# EAGLE design placa-gprs (EAGLE 5.10)
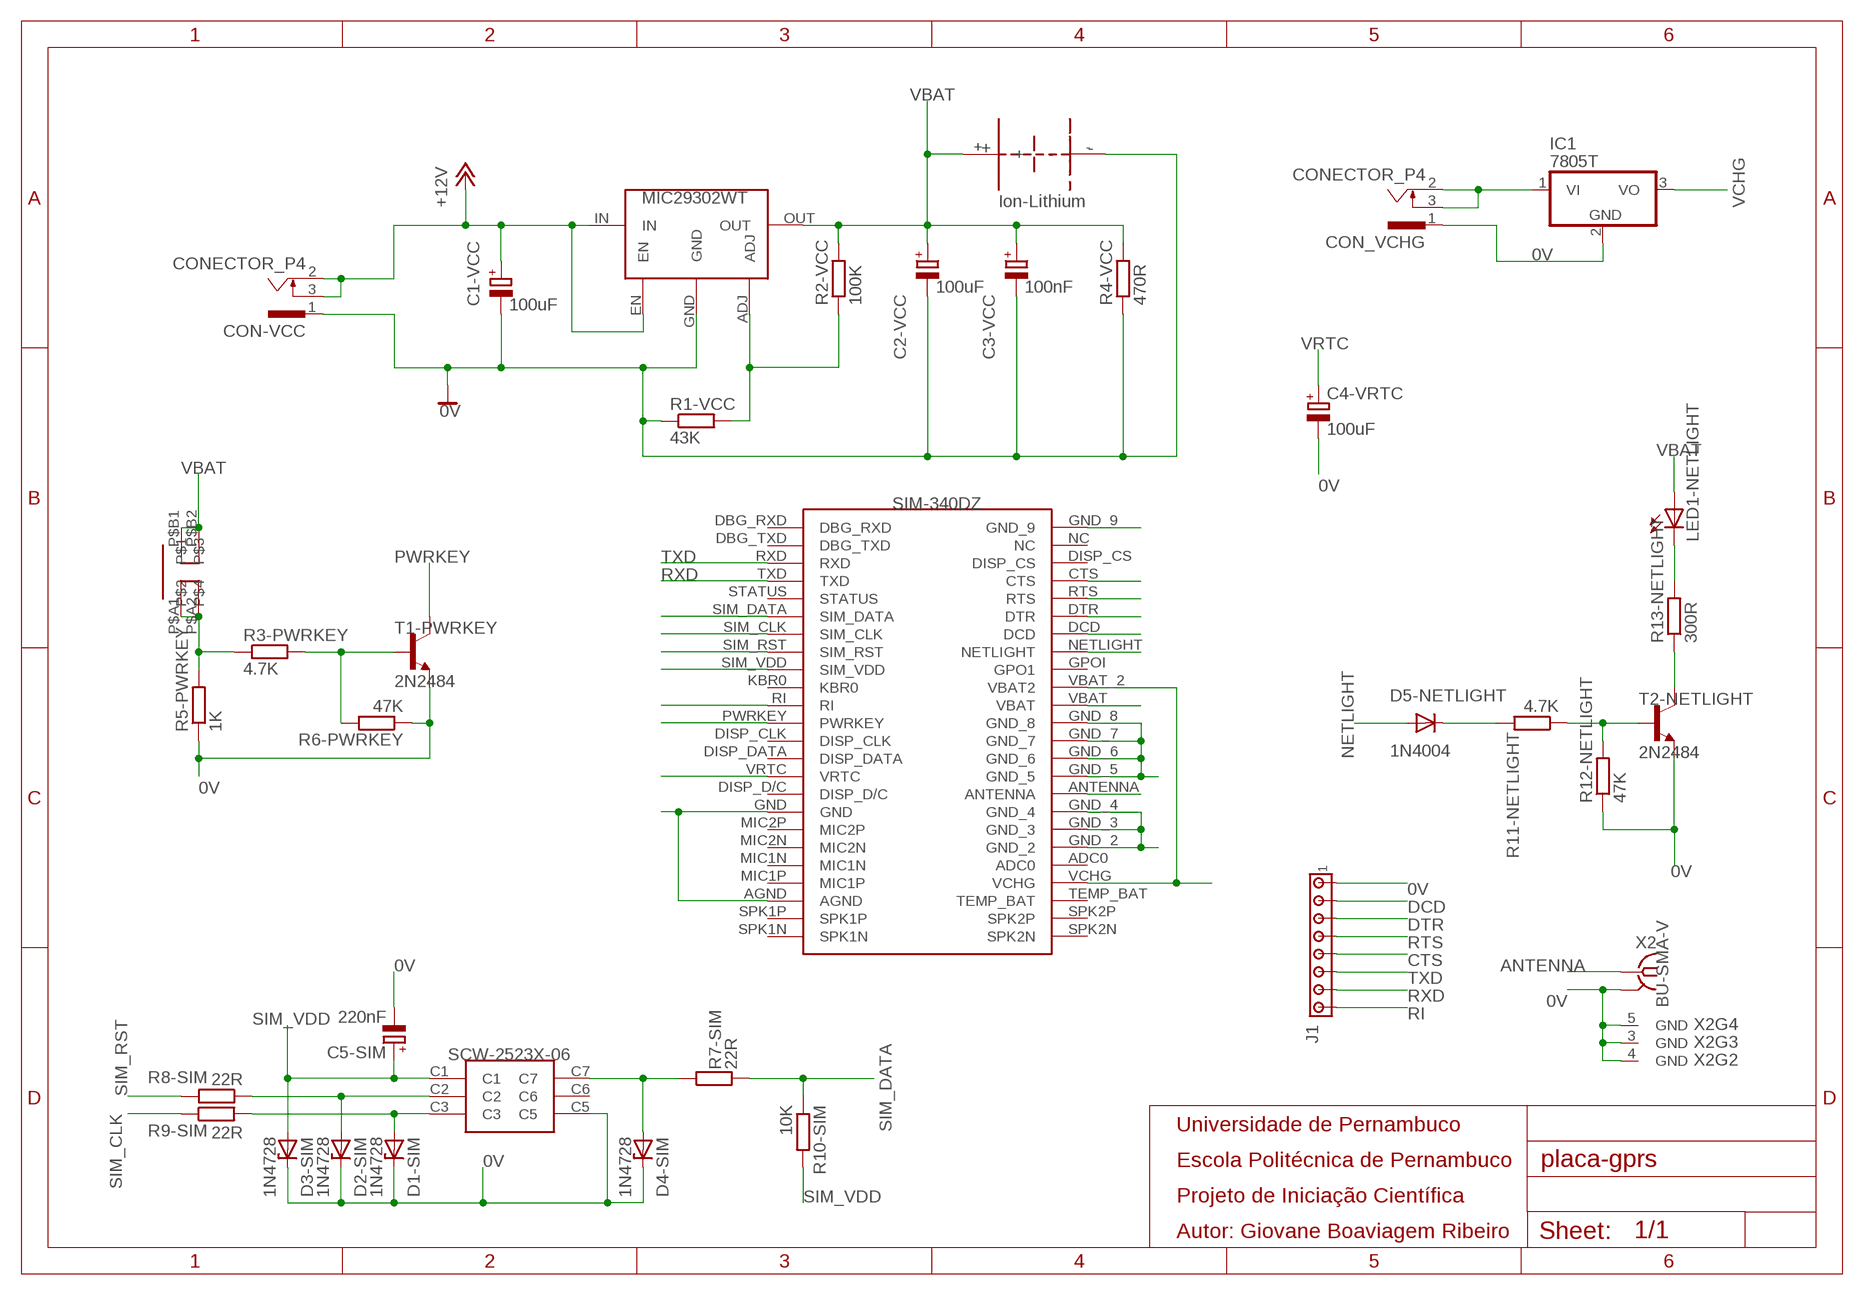
[diagram p0: schematic, sheet 1]

## Parts
C1-VCC  100uF  CPOL-EUTT5D10  [TT5D10]
C2-VCC  100uF  CPOL-EUTT5D10  [TT5D10]
C3-VCC  100nF  CPOL-EUTT5D10  [TT5D10]
C4-VRTC  100uF  CPOL-EUE1.8-4  [E1,8-4]
C5-SIM  220nF  CPOL-EUTT5D10  [TT5D10]
CON-VCC  CONECTOR_P4  [CONECTOR_P4]
CON_VCHG  CONECTOR_P4  [CONECTOR_P4]
D1-SIM  1N4728  [DO41Z10]
D2-SIM  1N4728  [DO41Z10]
D3-SIM  1N4728  [DO41Z10]
D4-SIM  1N4728  [DO41Z10]
D5-NETLIGHT  1N4004  [DO41-10]
IC1  7805T  [TO220H]
J1  MTA08-156  [1X8MTA]
LED1-NETLIGHT  LED5MM  [LED5MM]
R1-VCC  43K  R-EU_0207/7  [0207/7]
R2-VCC  100K  R-EU_0207/7  [0207/7]
R3-PWRKEY  4.7K  R-EU_0204/7  [0204/7]
R4-VCC  470R  R-EU_0207/7  [0207/7]
R5-PWRKEY  1K  R-EU_0204/7  [0204/7]
R6-PWRKEY  47K  R-EU_0204/7  [0204/7]
R7-SIM  22R  R-EU_0207/7  [0207/7]
R8-SIM  22R  R-EU_0207/7  [0207/7]
R9-SIM  22R  R-EU_0207/7  [0207/7]
R10-SIM  10K  R-EU_0207/7  [0207/7]
R11-NETLIGHT  4.7K  R-EU_0207/7  [0207/7]
R12-NETLIGHT  47K  R-EU_0207/7  [0207/7]
R13-NETLIGHT  300R  R-EU_0207/7  [0207/7]
T1-PWRKEY  2N2484  [TO18]
T2-NETLIGHT  2N2484  [TO18]
U$1  BATERIA_3_PINOS  [BATERIA_3_PINOS]
U$2  MIC29302WT  [MIC29302WT]
U$3  BOTAO  [BOTAO_4]
U$4  SCV-W2523X-06  [SCV-W2523X-06]
U$5  SIM-340DZ  [SIM-340DZ]
X2  BU-SMA-V  [BU-SMA-V]

## Nets
0V: C1-VCC.- C2-VCC.- C3-VCC.- C4-VRTC.- C5-SIM.- CON-VCC.1 CON_VCHG.1 D1-SIM.C D2-SIM.C D3-SIM.C D4-SIM.C IC1.2(GND) J1.1 R1-VCC.1 R4-VCC.1 R5-PWRKEY.1 R6-PWRKEY.1 R12-NETLIGHT.1 T1-PWRKEY.1(E) T2-NETLIGHT.1(E) U$1.- U$2.GND U$4.C5 U$5.AGND U$5.GND U$5.GND_2 U$5.GND_3 U$5.GND_4 U$5.GND_5 U$5.GND_6 U$5.GND_7 U$5.GND_8 U$5.GND_9 X2.2(GND) X2.3(GND) X2.4(GND) X2.5(GND)
+12V: C1-VCC.+ CON-VCC.2 CON-VCC.3 CON_VCHG.2 CON_VCHG.3 IC1.1(VI) U$2.EN U$2.IN
ANTENNA: U$5.ANTENNA X2.1
CTS: J1.5 U$5.CTS
DCD: J1.2 U$5.DCD
DTR: J1.3 U$5.DTR
N$1: R3-PWRKEY.1 R5-PWRKEY.2 U$3.P$A1 U$3.P$A2
N$2: R3-PWRKEY.2 R6-PWRKEY.2 T1-PWRKEY.2(B)
N$3: R1-VCC.2 R2-VCC.1 U$2.ADJ
N$4: D4-SIM.A R7-SIM.1 U$4.C7
N$5: D1-SIM.A R9-SIM.2 U$4.C3
N$6: D2-SIM.A R8-SIM.1 U$4.C2
N$7: LED1-NETLIGHT.K(C) R13-NETLIGHT.2
N$8: D5-NETLIGHT.C R11-NETLIGHT.2
N$9: R11-NETLIGHT.1 R12-NETLIGHT.2 T2-NETLIGHT.2(B)
N$10: R13-NETLIGHT.1 T2-NETLIGHT.3(C)
NETLIGHT: D5-NETLIGHT.A U$5.NETLIGHT
PWRKEY: T1-PWRKEY.3(C) U$5.PWRKEY
RI: J1.8 U$5.RI
RTS: J1.4 U$5.RTS
RXD: J1.7 U$5.TXD
SIM_CLK: R9-SIM.1 U$5.SIM_CLK
SIM_DATA: R7-SIM.2 R10-SIM.1 U$5.SIM_DATA
SIM_RST: R8-SIM.2 U$5.SIM_RST
SIM_VDD: C5-SIM.+ D3-SIM.A R10-SIM.2 U$4.C1 U$5.SIM_VDD
TXD: J1.6 U$5.RXD
VBAT: C2-VCC.+ C3-VCC.+ LED1-NETLIGHT.A R2-VCC.2 R4-VCC.2 U$1.+ U$2.OUT U$3.P$B1 U$3.P$B2 U$5.VBAT
VCHG: IC1.3(VO) U$5.VBAT_2(VBAT2) U$5.VCHG
VRTC: C4-VRTC.+ U$5.VRTC
Unconnected: U$4.C6 U$5.ADC0 U$5.DBG_RXD U$5.DBG_TXD U$5.DISP_CLK U$5.DISP_CS U$5.DISP_D/C U$5.DISP_DATA U$5.GPOI(GPO1) U$5.KBR0 U$5.MIC1N U$5.MIC1P U$5.MIC2N U$5.MIC2P U$5.NC U$5.SPK1N U$5.SPK1P U$5.SPK2N U$5.SPK2P U$5.STATUS U$5.TEMP_BAT

## Notes on the sheet
- Universidade de Pernambuco
- Escola Politécnica de Pernambuco
- Projeto de Iniciação Científica
- Autor: Giovane Boaviagem Ribeiro

## Library data of the parts
C1-VCC C2-VCC C3-VCC C4-VRTC C5-SIM = rcl:CPOL-EU: POLARIZED CAPACITOR, European symbol
CON-VCC CON_VCHG = canivete:CONECTOR_P4
D1-SIM D2-SIM D3-SIM D4-SIM = diode:1N4728: Z DIODE 3.3 V, 1W, 5 percent
D5-NETLIGHT = diode:1N4004: DIODE general purpose rectifier, 1 A
IC1 = linear:78*: Positive VOLTAGE REGULATOR Source: http://cache.national.com/ds/LM/LM78L05.pdf http://www.fairchildsemi.com/ds/LM/LM7805.pdf
J1 = con-amp:MTA08-156: AMP connector
LED1-NETLIGHT = led:LED: LED OSRAM: - CHIPLED LG R971, LG N971, LY N971, LG Q971, LY Q971, LO R971, LY R971 LH N974, LH R974 LS Q976, LO Q976, LY Q976 LO Q996 - Hyper CHIPLED LW Q18S LB Q993, LB Q99A, LB R99A - SideLED LS A670, LO A670, LY A670, LG A670, LP A670 LB A673, LV A673, LT A673, LW A673 LH A674 LY A675 LS A676, LA A676, LO A676, LY A676, LW A676 LS A679, LY A679, LG A679 - Hyper Micro SIDELED® LS Y876, LA Y876, LO Y876, LY Y876 LT Y87S - SmartLED LW L88C, LW L88S LB L89C, LB L89S, LG L890 LS L89K, LO L89K, LY L89K LS L896, LA L896, LO L896, LY L896 - TOPLED LS T670, LO T670, LY T670, LG T670, LP T670 LSG T670, LSP T670, LSY T670, LOP T670, LYG T670 LG T671, LOG T671, LSG T671 LB T673, LV T673, LT T673, LW T673 LH T674 LS T676, LA T676, LO T676, LY T676, LB T676, LH T676, LSB T676, LW T676 LB T67C, LV T67C, LT T67C, LS T67K, LO T67K, LY T67K, LW E67C LS E67B, LA E67B, LO E67B, LY E67B, LB E67C, LV E67C, LT E67C LW T67C LS T679, LY T679, LG T679 LS T770, LO T770, LY T770, LG T770, LP T770 LB T773, LV T773, LT T773, LW T773 LH T774 LS E675, LA E675, LY E675, LS T675 LS T776, LA T776, LO T776, LY T776, LB T776 LHGB T686 LT T68C, LB T68C - Hyper Mini TOPLED® LB M676 - Mini TOPLED Santana® LG M470 LS M47K, LO M47K, LY M47K Source: http://www.osram.convergy.de LUXEON: - LUMILED® LXK2-PW12-R00, LXK2-PW12-S00, LXK2-PW14-U00, LXK2-PW14-V00 LXK2-PM12-R00, LXK2-PM12-S00, LXK2-PM14-U00 LXK2-PE12-Q00, LXK2-PE12-R00, LXK2-PE12-S00, LXK2-PE14-T00, LXK2-PE14-U00 LXK2-PB12-K00, LXK2-PB12-L00, LXK2-PB12-M00, LXK2-PB14-N00, LXK2-PB14-P00, LXK2-PB14-Q00 LXK2-PR12-L00, LXK2-PR12-M00, LXK2-PR14-Q00, LXK2-PR14-R00 LXK2-PD12-Q00, LXK2-PD12-R00, LXK2-PD12-S00 LXK2-PH12-R00, LXK2-PH12-S00 LXK2-PL12-P00, LXK2-PL12-Q00, LXK2-PL12-R00 Source: www.luxeon.com KINGBRIGHT: KA-3528ASYC Source: www.kingbright.com
R1-VCC R2-VCC R3-PWRKEY R4-VCC R5-PWRKEY R6-PWRKEY R7-SIM R8-SIM R9-SIM R10-SIM R11-NETLIGHT R12-NETLIGHT R13-NETLIGHT = rcl:R-EU_: RESISTOR, European symbol
T1-PWRKEY T2-NETLIGHT = transistor:2N2484: NPN TRANSISTOR
U$1 = canivete:BATERIA_3_PINOS: Bateria de íon-lítio com 3 pinos.
U$2 = canivete:MIC29302WT: Regulador de tensão ajustável
U$3 = canivete:BOTAO: Botão simples. Não há a obrigatoriedade de utilizar os 4 pinos.
U$4 = canivete:SCV-W2523X-06: Soquete para SIM Card
U$5 = canivete:SIM-340DZ: Módulo GSM/GPRS
X2 = con-coax:BU-SMA-V: FEMALE SMA CONNECTOR Radiall distributor RS 112-3794

## Net classes
1 Placas caseiras: width 0.5 mm, drill 1 mm, clearance 0.5 mm

## Board
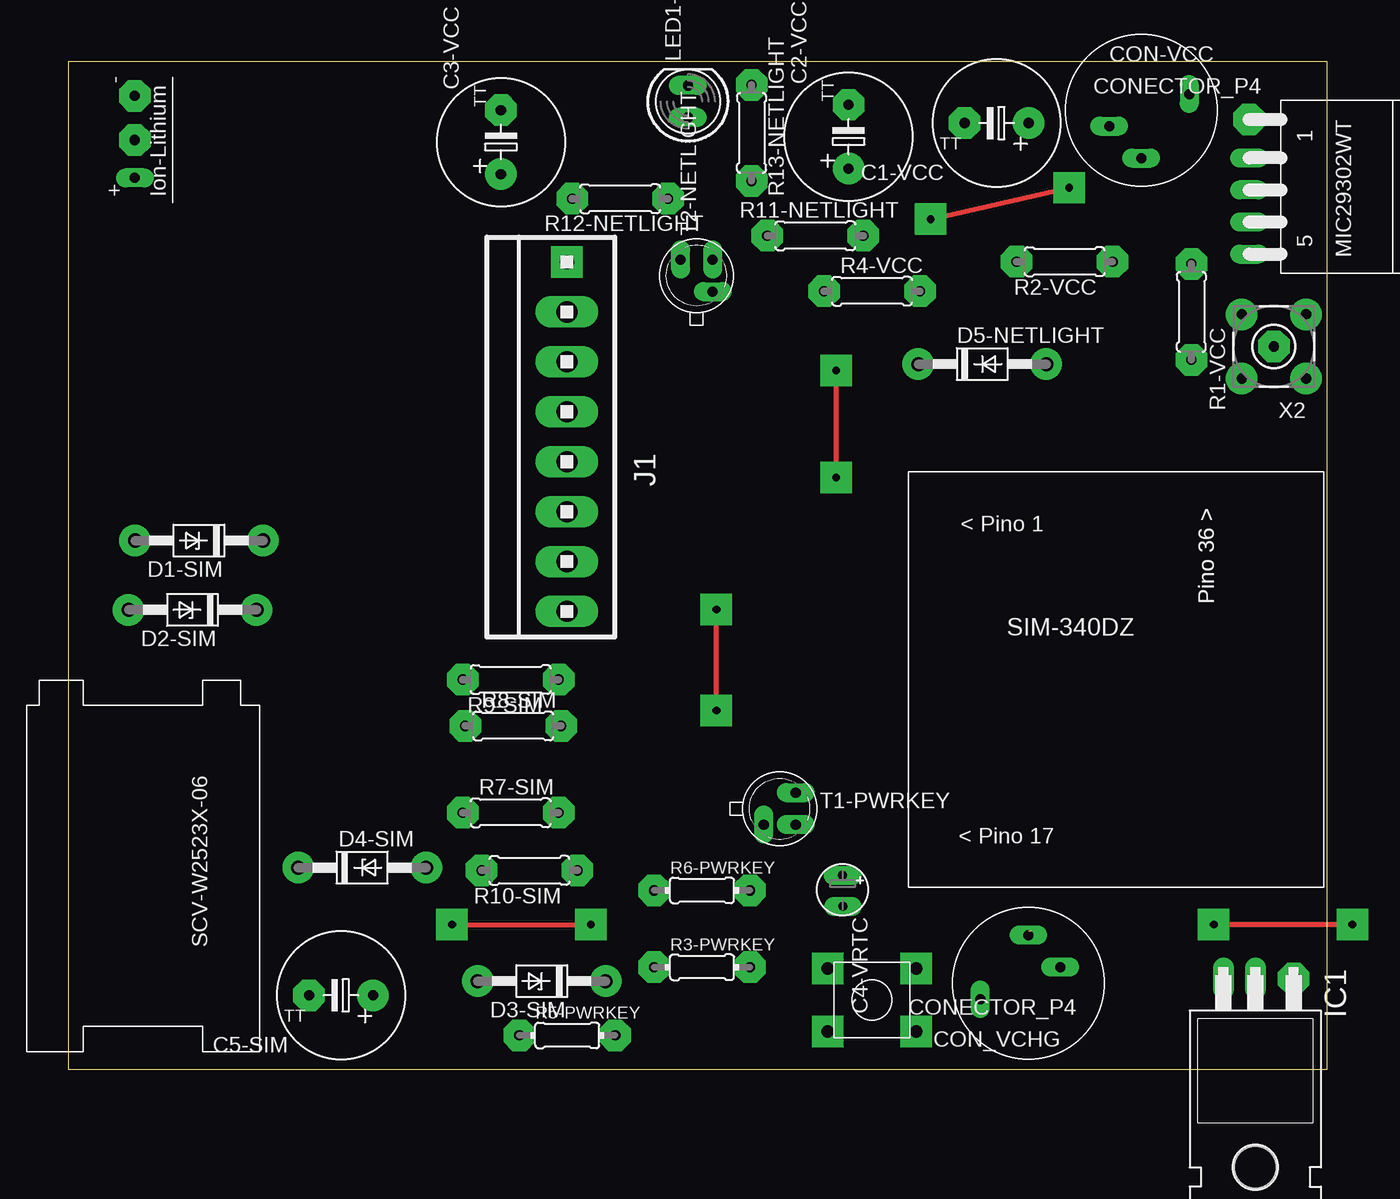
[diagram p1: board, top side]
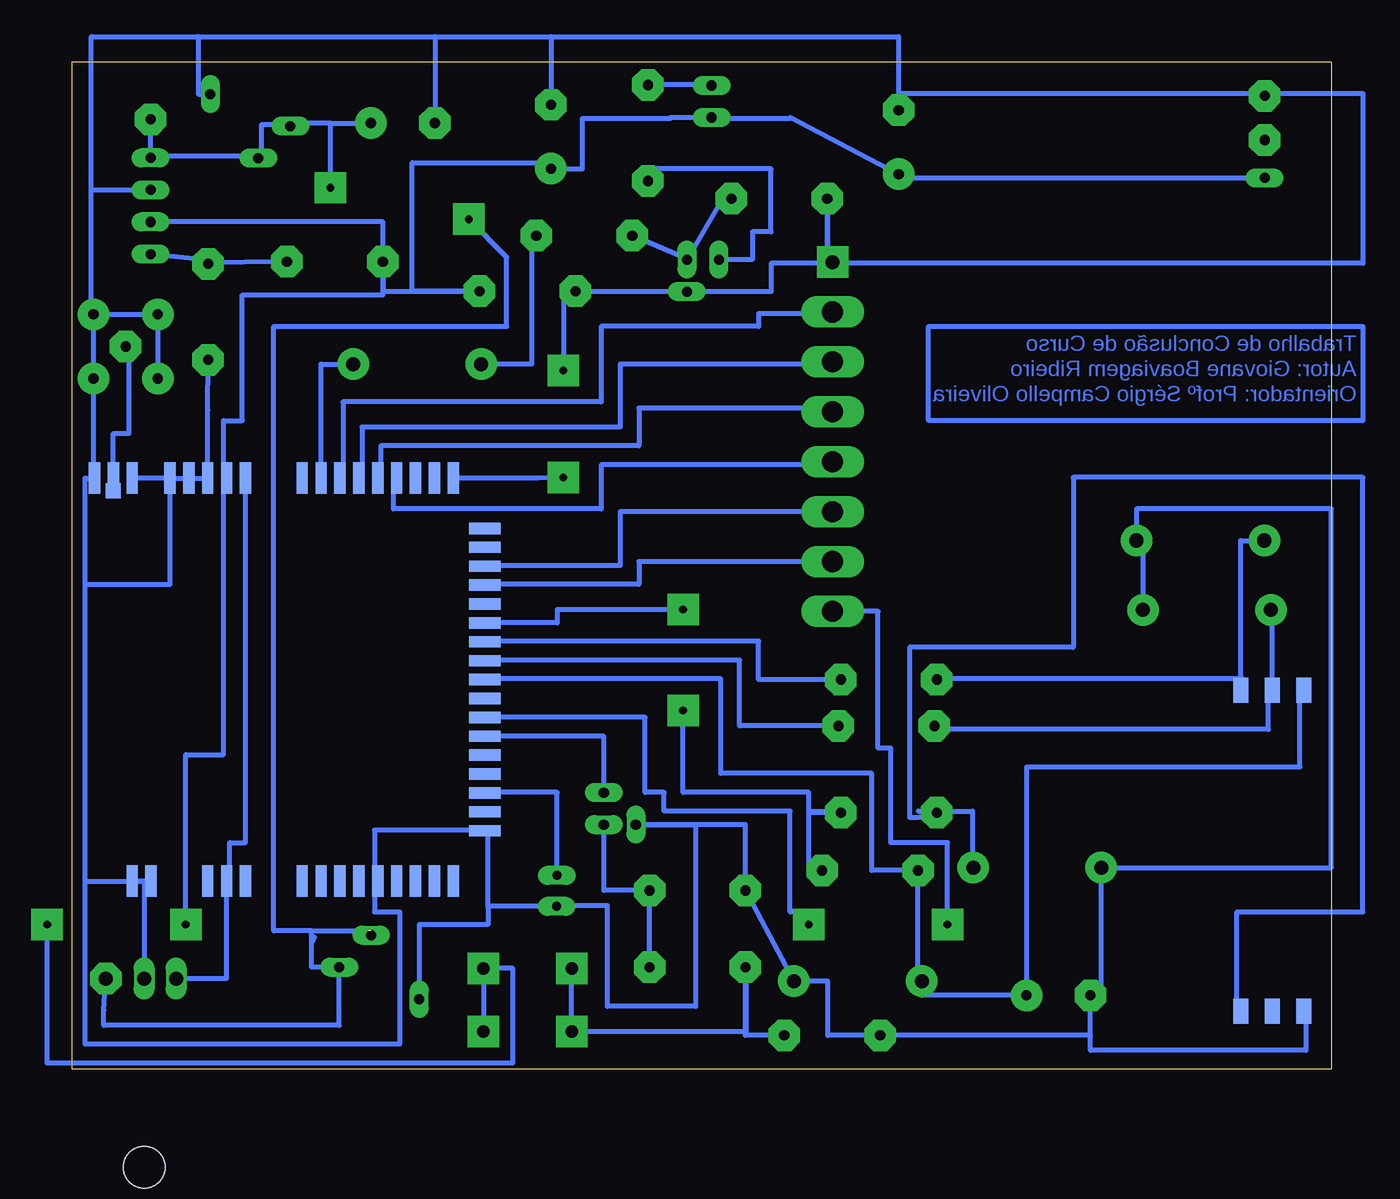
[diagram p2: board, bottom side, seen from below]

Size 100 x 80 mm. Coordinates in mm from the lower left corner, seen from the top.
Outline: 0,0 100,0 100,80 0,80 0,0
Copper layers (1*16): Top 0mm / dielectric 1.5mm / Bottom 0.035mm
Design rules "default *": minimum track width 1mm, minimum drill 24mil, track to track 8mil, track to pad 8mil, pad to pad 8mil, via to via 8mil, smd to smd 8mil, copper to edge 40mil, drill to drill 8mil, minimum pad ring 10mil, minimum via ring 8mil, stop-mask expansion 4mil, vias tented up to drill 0mil, thermal gap 10mil

### Footprints (pad centres in the part's own frame; a part is rotated, then mirrored left to right if it is on the bottom)
TT5D10 = drill 0.813 pad 2.5 round: + -2.54,0 | drill 0.813 pad 2.5 octagon: - 2.54,0
E1,8-4 = drill 0.711 pad 1.5 long: + -1.15,0.011; - 1.3,0.039
CONECTOR_P4 = drill 0.8 pad 1.5 long: 1 -1.27,3.81; 2 3.81,0; 3 1.27,-2.54
DO41Z10 = drill 1.118 pad 2.5 round: A 5.08,0; C -5.08,0
DO41-10 = drill 1.118 pad 2.5 round: A 5.08,0; C -5.08,0
TO220H = drill 1.118 pad 2.5 octagon: 1 -3.04,-10.16 | drill 1.118 long: 2 0,-10.16; 3 2.54,-10.16 | hole 3.302: 0,4.826
1X8MTA = drill 1.1 pad 2.5 square: 1 13.868,0 | drill 1.676 long: 2 9.906,0; 3 5.944,0; 4 1.981,0; 5 -1.981,0; 6 -5.944,0; 7 -9.906,0; 8 -13.868,0
LED5MM = drill 0.813 pad 1.5 long: A -1.27,0; K 1.27,0
0207/7 = drill 0.813 pad 2.5 octagon: 1 -3.81,0; 2 3.81,0
0204/7 = drill 0.813 pad 2.5 octagon: 1 -3.81,0; 2 3.81,0
TO18 = drill 0.813 pad 1.5 long: 1 -1.27,-1.27; 2 1.27,-1.27; 3 1.27,1.27
BATERIA_3_PINOS = drill 0.8 pad 1.5 long: + -3,0 | drill 0.8 pad 2.5 octagon: - 3.5,0; P$1 0,0
MIC29302WT = drill 0.8 pad 1.5 long: ADJ 5.096,-6.35; GND 0,-6.35; IN -2.548,-6.35; OUT 2.548,-6.35 | drill 0.8 pad 2.5 octagon: EN -5.596,-6.35
BOTAO_4 = drill 1 pad 2.5 square: P$A1 -3.5,2.5; P$A2 -3.5,-2.5; P$B1 3.5,-2.5; P$B2 3.5,2.5
SCV-W2523X-06 = smd 2 x 1.2 bottom: C1 -14.39,-5.08; C2 -14.39,-2.58; C3 -14.39,-0.08; C5 11.11,-5.08; C6 11.11,-2.58; C7 11.11,-0.08
SIM-340DZ = smd 0.9 x 2.5 bottom: ADC0 5.82,-15.65; AGND -7.68,-15.65; ANTENNA 13.32,16.35; CTS -9.18,16.35; DCD -4.68,16.35; DISP_CS -10.68,16.35; DTR -6.18,16.35; GND_2 10.32,-15.65; GND_3 11.82,-15.65; GND_4 14.82,16.35; GND_5 11.82,16.35; GND_6 8.82,16.35; GND_7 7.32,16.35; GND_8 5.82,16.35; GND_9 -13.68,16.35; GPOI -1.68,16.35; MIC1N -10.68,-15.65; MIC1P -9.18,-15.65; MIC2N -12.18,-15.65; MIC2P -13.68,-15.65; NC -12.18,16.35; NETLIGHT -3.18,16.35; RTS -7.68,16.35; SPK1N -4.68,-15.65; SPK1P -6.18,-15.65; SPK2N -3.18,-15.65; SPK2P -1.68,-15.65; TEMP_BAT 2.82,-15.65; VBAT 4.32,16.35; VBAT_2 2.82,16.35; VCHG 4.32,-15.65 | smd 2.5 x 0.9 bottom: DBG_RXD -16.18,12.35; DBG_TXD -16.18,10.85; DISP_CLK -16.18,-5.65; DISP_D/C -16.18,-10.15; DISP_DATA -16.18,-7.15; GND -16.18,-11.65; KBR0 -16.18,-1.15; PWRKEY -16.18,-4.15; RI -16.18,-2.65; RXD -16.18,9.35; SIM_CLK -16.18,3.35; SIM_DATA -16.18,4.85; SIM_RST -16.18,1.85; SIM_VDD -16.18,0.35; STATUS -16.18,6.35; TXD -16.18,7.85; VRTC -16.18,-8.65 | smd 1.2 x 1.2 bottom:  13.32,15.35
BU-SMA-V = drill 0.813 pad 2.5 octagon: 1 0,0 | drill 0.813 pad 2.5 round: 2 -2.55,2.55; 3 2.55,2.55; 4 2.55,-2.55; 5 -2.55,-2.55

### Placement (x,y rotation side)
C1-VCC  73.75,75.14 180 top
C2-VCC  61.99,74.05 90 top
C3-VCC  34.38,73.62 90 top
C4-VRTC  61.51,14.25 270 top
C5-SIM  21.68,5.88 180 top
CON-VCC  85.24,76.16 270 top
CON_VCHG  76.27,6.84 90 top
D1-SIM  10.4,41.99 180 top
D2-SIM  9.89,36.49 180 top
D3-SIM  37.62,7.01 180 top
D4-SIM  23.36,16.01 0 top
D5-NETLIGHT  72.61,55.99 0 top
IC1  94.3,-2.95 180 top
J1  39.62,50.23 90 top
LED1-NETLIGHT  49.23,76.85 90 top
R1-VCC  89.22,60.15 90 top
R2-VCC  79.15,64.13 180 top
R3-PWRKEY  50.35,8.11 0 top
R4-VCC  63.85,61.79 0 top
R5-PWRKEY  39.65,2.7 0 top
R6-PWRKEY  50.35,14.21 0 top
R7-SIM  35.15,20.38 0 top
R8-SIM  35.35,27.27 0 top
R9-SIM  35.15,30.95 180 top
R10-SIM  36.65,15.8 180 top
R11-NETLIGHT  59.35,66.19 0 top
R12-NETLIGHT  43.85,69.13 0 top
R13-NETLIGHT  54.29,74.35 90 top
T1-PWRKEY  56.52,20.7 0 top
T2-NETLIGHT  49.92,63.02 90 top
U$1  5.3,73.79 90 top
U$2  100.14,69.83 270 top
U$3  63.85,5.51 0 top
U$4  7.29,15.72 270 top
U$5  83.43,30.6 0 top
X2  95.77,57.4 180 top

### Tracks (layer width: path | path; a pad name or v marks a point on that pad's centre or on a via)
0V  (via drill 0.6 pad 2.5)
  Top 0.406: v61,55.5 v61,47
  Bottom 0.406: U$4.C5 2,4.61 2,1.5 19.14,1.5 19.14,2.7 | 19.14,2.7 C5-SIM.- 18.28,5.88 D4-SIM.C 0,16.01 0,44.5 15.48,44.5 D1-SIM.C 14.97,41.99 D2-SIM.C | 19.14,2.7 R5-PWRKEY.1 40,2.7 40,7 42.2,7 D3-SIM.C R6-PWRKEY.1 46.54,19.43 T1-PWRKEY.1 50.5,19.43 50.5,5 57.5,5 57.5,13 61.55,13 C4-VRTC.- 67,12.95 | U$5.GND_2 U$5.GND_3 | U$5.GND_2 94.3,14.95 IC1.2 | 34.38,77.5 5.5,77.5 5,77.29 U$1.- 5.3,77.5 -2.5,77.5 -2.5,64 39.62,64 | X2.5 X2.4 X2.3 | X2.5 X2.2 98.32,46.95 U$5.GND_4 99,46.95 99,38.5 | U$5.GND_6 U$5.GND_5 | U$5.GND_6 U$5.GND_7 U$5.GND_8 89.25,52.34 R1-VCC.1 | 98.5,69.83 U$2.GND | 98.5,69.83 98.5,61 98.32,60 X2.5 | CON-VCC.1 90,77.43 90,82 | 90,82 98.5,82 98.5,69.83 | 90,82 71.21,82 | 71.21,82 C1-VCC.- | 71.21,82 62,82 | 39.62,64 40,64 | 40,64 44.5,64 44.5,61.75 T2-NETLIGHT.1 60.04,61.75 R4-VCC.1 61,61.79 v61,55.5 | 39.62,64 J1.1 40.04,64.1 R12-NETLIGHT.1 40,69.13 40,64 | C2-VCC.- 62,82 | 62,82 34.38,82 34.38,77.5 | 34.38,77.5 C3-VCC.- | U$5.GND_9 63,46.95 v61,47 | 76,14.95 U$5.AGND | 76,14.95 76,19 67.25,19 U$5.GND 67,18.95 67,12.95 | 99,38.5 92.25,38.5 U$5.GND_6 | 99,14.95 U$5.GND_2 | 99,14.95 99,38.5 | 67,12.95 67,11.5 72.46,11.5 CON_VCHG.1 | 76,14.95 76,12.5 74,12.5 74,2 99,2 99,14.95
+12V  (via drill 0.6 pad 2.5)  (1 unrouted)
  Top 0.406: v68.5,67.5 v79.5,70
  Bottom 0.406: IC1.1 97.5,4.71 97.5,3.5 78.81,3.5 CON_VCHG.3 81,8.11 81,10 | 81,10 80.77,10.5 | U$2.EN U$2.IN 93,72.38 93,72.5 86.24,72.5 CON-VCC.2 85,72.35 85,75 83.7,75 CON-VCC.3 83.7,75.14 79.5,75.14 | 81,10 81,11 | 76.5,11 76.5,10.5 76,10.5 | 81,11 76.27,11 CON_VCHG.2 | 81,11 84,11 84,59 65.5,59 65.5,64.5 v68.5,67.5 | 79.5,75.14 C1-VCC.+ | v79.5,70 79.5,75.14
ANTENNA
  Bottom 0.406: X2.1 95.5,57.4 95.5,50.5 96.75,50.5 U$5.ANTENNA
CTS
  Bottom 0.406: U$5.CTS 74.5,46.95 74.5,44.5 58,44.5 58,48 41.62,48 J1.5
DCD
  Bottom 0.406: U$5.DCD 78.5,46.95 78.5,53 58,53 58,59 45.5,59 45.5,60 42.12,60 J1.2
DTR
  Bottom 0.406: U$5.DTR 77,46.95 77,51 56.5,51 56.5,56 41.62,56 J1.3
N$1
  Bottom 0.406: R5-PWRKEY.2 46.54,2.7 R3-PWRKEY.1 46.5,8.11 46.5,3 U$3.P$A2 U$3.P$A1
N$2
  Bottom 0.406: R3-PWRKEY.2 R6-PWRKEY.2 57.79,14.21 T1-PWRKEY.2
N$3
  Bottom 0.406: R2-VCC.1 89.72,64.04 R1-VCC.2 89.22,64.23 U$2.ADJ
N$4
  Bottom 0.406: D4-SIM.A 28.5,16.01 28.5,20.5 32.84,20.5 R7-SIM.1 32.84,20 33.5,20 33.5,33.5 20.5,33.5 20.5,47 -2.5,47 -2.5,12.5 7.5,12.5 7.5,4.61 U$4.C7
N$5
  Bottom 0.406: D1-SIM.A 7.21,41.99 U$4.C3 7,30.11 7,31 31.34,31 R9-SIM.2
N$6
  Bottom 0.406: D2-SIM.A 4.71,36.49 U$4.C2 5,30.11 5,27 31.54,27 R8-SIM.1
N$7
  Bottom 0.406: R13-NETLIGHT.2 49.23,78.16 LED1-NETLIGHT.K
N$8
  Bottom 0.406: D5-NETLIGHT.C 63.5,55.99 63.5,66 63.16,66 R11-NETLIGHT.2
N$9
  Bottom 0.406: R12-NETLIGHT.2 48.35,69.13 T2-NETLIGHT.2 51.19,64.5 51.5,64.5 55.5,66.19 R11-NETLIGHT.1
N$10
  Bottom 0.406: T2-NETLIGHT.3 46,64.29 46,66.5 44.5,66.5 44.5,71.5 54.29,71.5 R13-NETLIGHT.1
N$11
  Bottom 0.406: -2.5,59 -2.5,51.5 32,51.5 32,59 -2.5,59
NETLIGHT
  Bottom 0.406: D5-NETLIGHT.A 80.25,55.99 U$5.NETLIGHT
PWRKEY
  Bottom 0.406: U$5.PWRKEY 57.79,26.45 T1-PWRKEY.3
RI  (via drill 0.6 pad 2.5)
  Top 0.406: v30.5,11.5 v41.5,11.5
  Bottom 0.406: U$5.RI 54.5,27.95 54.5,22 53,22 53,20.5 43,20.5 43,12.5 42.5,12.5 v41.5,11.5 | J1.8 36,36.36 36,25.5 35,25.5 35,18 30.5,18 v30.5,11.5
RTS
  Bottom 0.406: U$5.RTS 75.5,46.95 75.5,49.5 55,49.5 55,52.5 41.12,52.5 J1.4
RXD
  Bottom 0.406: J1.7 55,40.32 55,38.5 67.25,38.5 U$5.TXD
SIM_CLK
  Bottom 0.406: R9-SIM.1 45.5,30.95 45.5,34 67.25,34 U$5.SIM_CLK
SIM_DATA  (via drill 0.6 pad 2.5)
  Top 0.406: v51.5,28.5 v51.5,36.5
  Bottom 0.406: R10-SIM.1 41.5,15.8 41.5,20.5 38.96,20.5 R7-SIM.2 41.5,20.38 41.5,22 51.5,22 v51.5,28.5 | U$5.SIM_DATA 61.5,35.45 61.5,36.5 v51.5,36.5
SIM_RST
  Bottom 0.406: R8-SIM.2 47,27.27 47,32.5 67.25,32.5 U$5.SIM_RST
SIM_VDD
  Bottom 0.406: U$4.C1 2.5,30.11 2.5,24 24.22,24 C5-SIM.+ 32.54,5.88 D3-SIM.A 32.84,7.01 R10-SIM.2 36.5,15.8 36.5,23.5 48.5,23.5 48.5,31 67.25,31 U$5.SIM_VDD
TXD
  Bottom 0.406: J1.6 56.5,44.29 56.5,40 67.25,40 U$5.RXD
VBAT  (via drill 0.6 pad 2.5)
  Top 0.406: v102,11.5 v91,11.5
  Bottom 0.406: U$1.+ 34.38,70.79 C3-VCC.+ 43,75.58 43,75.5 49.23,75.5 LED1-NETLIGHT.A 52.5,75.58 52.5,75.5 59.5,75.5 59.5,71.5 C2-VCC.+ 61.99,72 73,72 73,61.79 R4-VCC.2 75.34,61.79 R2-VCC.2 | U$3.P$B1 U$3.P$B2 65,8.01 65,0.5 102,0.5 v102,11.5 | 88,46.95 88,51.5 86.5,51.5 86.5,61.5 75.34,61.5 R2-VCC.2 | U$2.OUT 75.34,67.28 R2-VCC.2 | 88,46.95 U$5.VBAT | 88,46.95 88,25 91,25 v91,11.5
VCHG
  Bottom 0.406: IC1.3 87.75,7.21 U$5.VCHG 87.5,14.95 87.5,18 86.25,18 U$5.VBAT_2
VRTC
  Bottom 0.406: C4-VRTC.+ 61.5,15.4 61.5,22 67.25,22 U$5.VRTC

### Text on the board
Bottom: Trabalho de Conclusão de Curso | Autor: Giovane Boaviagem Ribeiro | Orientador: Profº Sérgio Campello Oliveira